# EAGLE schematic z80sim_pio_3_board2_v3 (EAGLE 9.6.2)

## Sheet 1 of 2
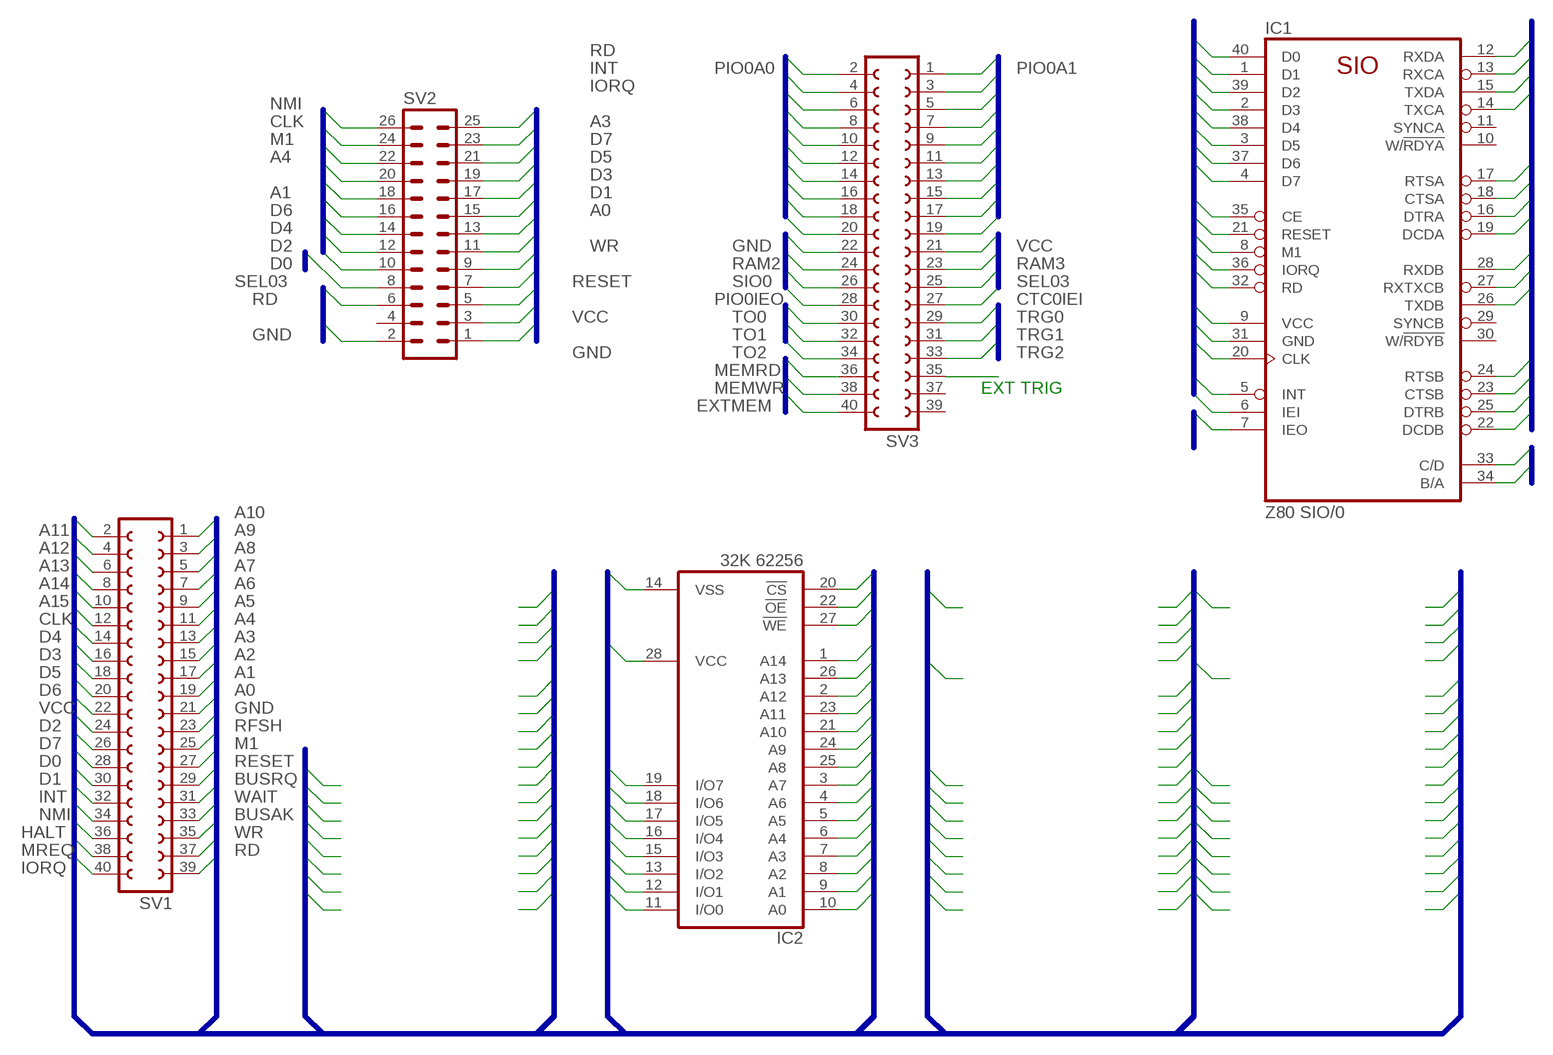
[diagram p0: schematic, sheet 1]

### Parts
IC1  Z80 SIO/0  Z80SIO  [DIL40]
IC2  32K 62256  62256P  [DIL28-6]
SV1  FE20-2  [FE20-2]
SV2  MA13-2  [MA13-2]
SV3  FE20-2  [FE20-2]

### Nets
32K_SEL: IC2.20(!CS) ; also sheet 2
A0: IC1.34(B/A) IC2.10(A0) SV1.21 SV2.9
A1: IC1.33(C/D) IC2.9(A1) SV1.19 SV2.18
A2: IC2.8(A2) SV1.17
A3: IC2.7(A3) SV1.15 SV2.19
A4: IC2.6(A4) SV1.13 SV2.20
A5: IC2.5(A5) SV1.11
A6: IC2.4(A6) SV1.9
A7: IC2.3(A7) SV1.7
A8: IC2.25(A8) SV1.5
A9: IC2.24(A9) SV1.3
A10: IC2.21(A10) SV1.1
A11: IC2.23(A11) SV1.2
A12: IC2.2(A12) SV1.4
A13: IC2.26(A13) SV1.6
A14: IC2.1(A14) SV1.8
A15: SV1.10
BUSAK: SV1.35
BUSRQ: SV1.31
CLK: IC1.20(CLK) SV1.12 SV2.24
CTC0IEI: IC1.7(IEO) SV3.27 ; also sheet 2
CTSA: IC1.18(CTSA)
CTSB: IC1.23(CTSB)
D0: IC1.40(D0) IC2.11(I/O0) SV1.28 SV2.10
D1: IC1.1(D1) IC2.12(I/O1) SV1.30 SV2.11
D2: IC1.39(D2) IC2.13(I/O2) SV1.24 SV2.12
D3: IC1.2(D3) IC2.15(I/O3) SV1.16 SV2.13
D4: IC1.38(D4) IC2.16(I/O4) SV1.14 SV2.14
D5: IC1.3(D5) IC2.17(I/O5) SV1.18 SV2.15
D6: IC1.37(D6) IC2.18(I/O6) SV1.20 SV2.16
D7: IC1.4(D7) IC2.19(I/O7) SV1.26 SV2.17
DCDA: IC1.19(DCDA)
DCDB: IC1.22(DCDB)
DTRA: IC1.16(DTRA)
DTRB: IC1.25(DTRB)
EXTMEM: SV3.40 ; also sheet 2
GND: IC1.31(GND) IC2.14(VSS) SV1.23 SV2.1 SV2.2 SV3.22 ; also sheet 2
HALT: SV1.36
INT: IC1.5(INT) SV1.32 SV2.23
IORQ: IC1.36(IORQ) SV1.40 SV2.21 ; also sheet 2
M1: IC1.8(M1) SV1.27 SV2.22
MEMRD: IC2.22(!OE) SV3.36
MEMWR: IC2.27(!WE) SV3.38
MREQ: SV1.38
N$4: SV3.35
NMI: SV1.34 SV2.26
PIO0A0: SV3.2
PIO0A1: SV3.1
PIO0A2: SV3.4
PIO0A3: SV3.3
PIO0A4: SV3.6
PIO0A5: SV3.5
PIO0A6: SV3.8
PIO0A7: SV3.7
PIO0ARDY: SV3.10
PIO0ASTB: SV3.9
PIO0B0: SV3.12
PIO0B1: SV3.11
PIO0B2: SV3.14
PIO0B3: SV3.13
PIO0B4: SV3.16
PIO0B5: SV3.15
PIO0B6: SV3.18
PIO0B7: SV3.17
PIO0BRDY: SV3.20
PIO0BSTB: SV3.19
PIO0IEO: SV3.28
RAM2: SV3.24
RAM3: SV3.23
RD: IC1.32(RD) SV1.39 SV2.6 SV2.25
RESET: IC1.21(RESET) SV1.29 SV2.5
RFSH: SV1.25
RTSA: IC1.17(RTSA)
RTSB: IC1.24(RTSB)
RXCA: IC1.13(RXCA)
RXDA: IC1.12(RXDA)
RXDB: IC1.28(RXDB)
RXTXCB: IC1.27(RXTXCB)
SEL03: SV2.8 SV3.25
SIO0: IC1.35(CE) SV3.26
TO0: SV3.30
TO1: SV3.32
TO2: SV3.34
TRG0: SV3.29
TRG1: SV3.31
TRG2: SV3.33
TXCA: IC1.14(TXCA)
TXDA: IC1.15(TXDA)
TXDB: IC1.26(TXDB)
VCC: IC1.6(IEI) IC1.9(VCC) IC2.28(VCC) SV1.22 SV2.3 SV3.21 ; also sheet 2
WAIT: SV1.33
WR: SV1.37 SV2.7
Unconnected: IC1.10(W/!RDYA) IC1.11(SYNCA) IC1.29(SYNCB) IC1.30(W/!RDYB) SV2.4 SV3.37 SV3.39

### Buses
M1,MREQ,IORQ,RD,WR,RFSH,HALT,WAIT,INT,NMI,RESET,BUSRQ,BUSAK,CLK,GND,VCC,A[0..15],D[0..7],MEMRD,MEMWR,IORD,IOWR,ROM0,RAM1,RAM2,RAM3,PIO0,CTC0,CTC0IEO,PIO0IEO,SIO0,SIO0IEO,SEL03,32K_SEL,ALT_BOOT
PIO0A0,PIO0A1,PIO0A2,PIO0A3,PIO0A4,PIO0A5,PIO0A6,PIO0A7,PIO0B0,PIO0B1,PIO0B2,PIO0B3,PIO0B4,PIO0B5,PIO0B6,PIO0B7,PIO0ARDY,PIO0ASTB,PIO0BRDY,PIO0BSTB,PIO0ARDY,PIO0ASTB,PIO0BRDY,PIO0BSTB,CTC0TRG0,CTC0TO0,CTC0TRG1,CTC0TO1,CTC0TRG2,CTC0TO2,CTC0TRG3
M1,MREQ,IORQ,RD,WR,RFSH,HALT,WAIT,INT,NMI,RESET,BUSRQ,BUSAK,CLK,GND,VCC,A[0..15],D[0..7],MEMRD,MEMWR,IORD,IOWR,ROM0,RAM1,RAM2,RAM3,PIO0,CTC0,CTC0IEO,CTC0IEI,PIO0IEO,SIO0,SEL03,EXTMEM
TRG0,TO0,TRG1,TO1,TRG2,TO2,TRG3
RXDA,RXCA,TXDA,TXCA,RTSA,CTSA,DTRA,DCDA,RXDB,RXTXCB,TXDB,RTSB,CTSB,DTRB,DCDB

### Notes on the sheet
- EXT TRIG

## Sheet 2 of 2
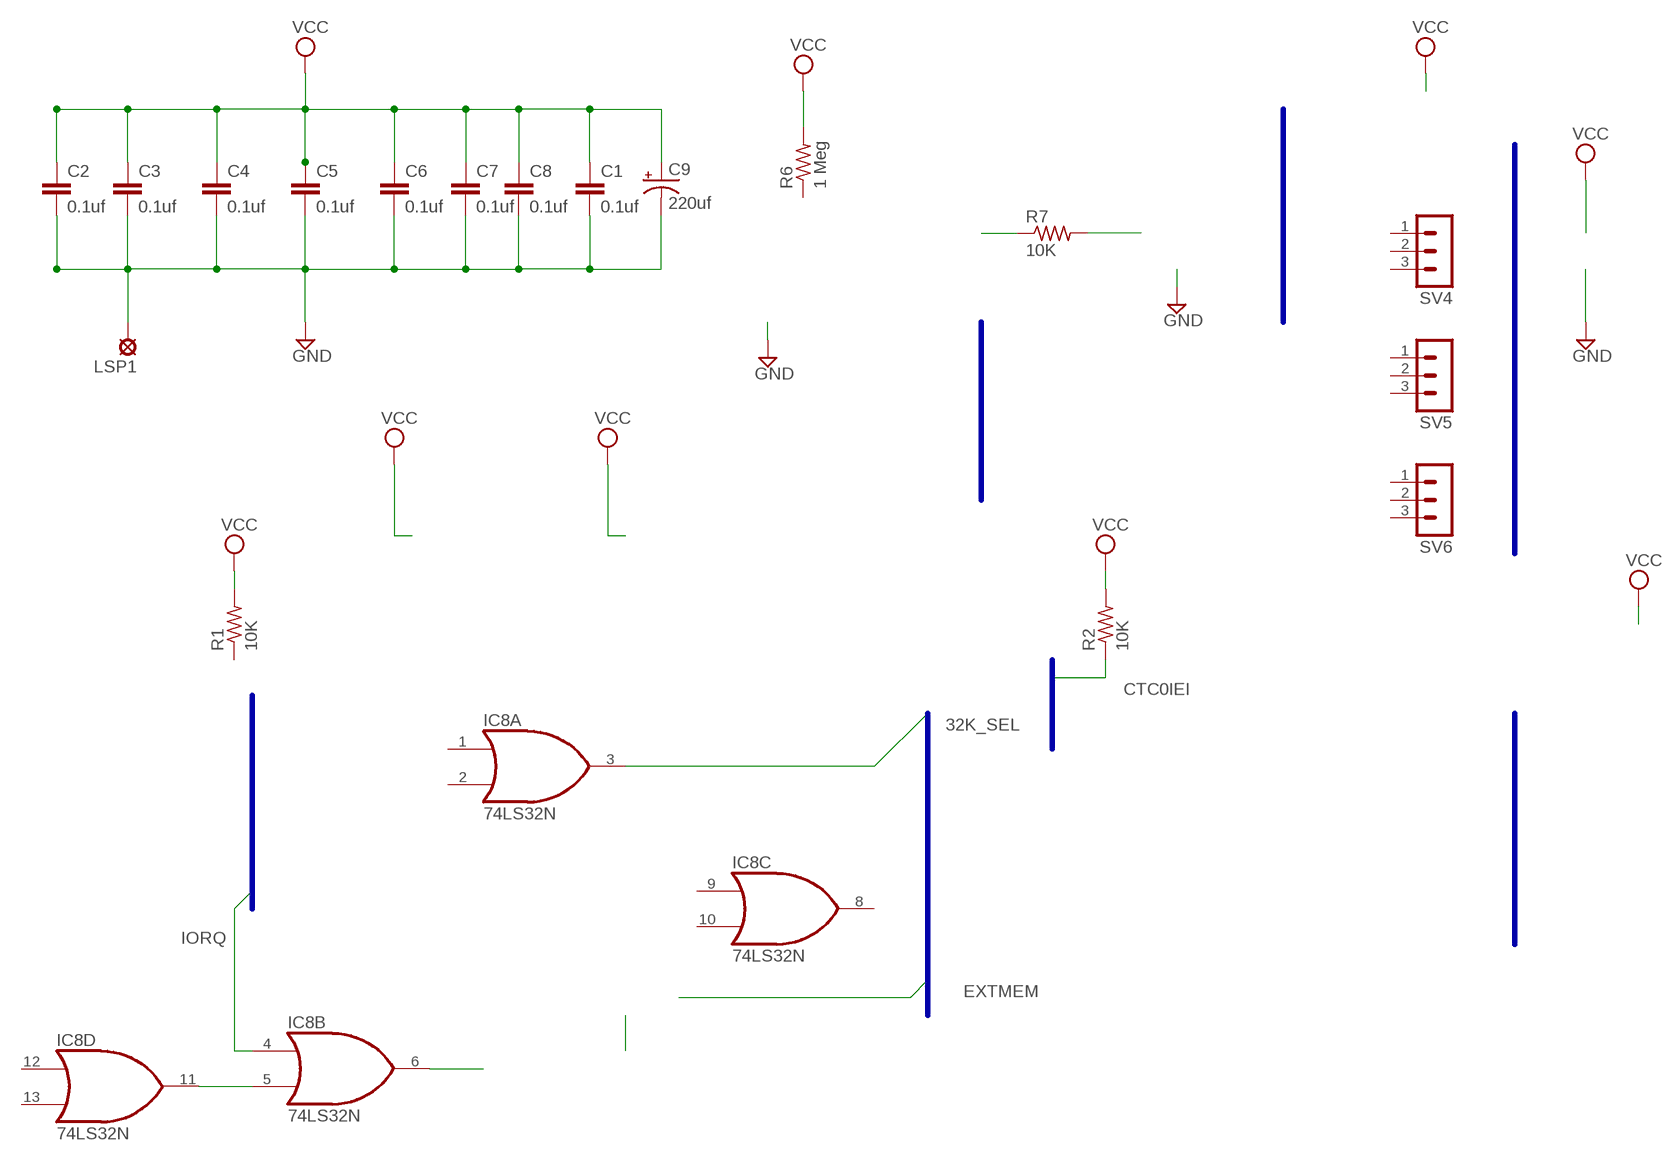
[diagram p1: schematic, sheet 2]

### Parts
C1  0.1uf  C5/3  [C5B3]
C2  0.1uf  C5/3  [C5B3]
C3  0.1uf  C5/3  [C5B3]
C4  0.1uf  C5/3  [C5B3]
C5  0.1uf  C5/3  [C5B3]
C6  0.1uf  C5/3  [C5B3]
C7  0.1uf  C5/3  [C5B3]
C8  0.1uf  C5/3  [C5B3]
C9  220uf  CPOL-USE3.5-10  [E3,5-10]
IC8  74LS32N  [DIL14]
LSP1  LSP13  [LSP13]
R1  10K  R-US_0204/7  [0204/7]
R2  10K  R-US_0204/7  [0204/7]
R6  1 Meg  R-US_0204/7  [0204/7]
R7  10K  R-US_0204/7  [0204/7]
SV4  MA03-1  [MA03-1]
SV5  MA03-1  [MA03-1]
SV6  MA03-1  [MA03-1]

### Nets
32K_SEL: IC8.3(A:O) ; also sheet 1
CTC0IEI: R2.1 ; also sheet 1
GND: C1.2 C2.2 C3.2 C4.2 C5.2 C6.2 C7.2 C8.2 C9.- LSP1.MP ; also sheet 1
IORQ: IC8.4(B:I0) ; also sheet 1
N$3: IC8.6(B:O)
N$6: IC8.5(B:I1) IC8.11(D:O)
N$9: R7.1
N$11: R7.2
VCC: C1.1 C2.1 C3.1 C4.1 C5.1 C6.1 C7.1 C8.1 C9.+ R1.2 R2.2 R6.2 ; also sheet 1
Unconnected: IC8.1(A:I0) IC8.2(A:I1) IC8.8(C:O) IC8.9(C:I0) IC8.10(C:I1) IC8.12(D:I0) IC8.13(D:I1) R1.1 R6.1 SV4.1 SV4.2 SV4.3 SV5.1 SV5.2 SV5.3 SV6.1 SV6.2 SV6.3

### Buses
M1,MREQ,IORQ,RD,WR,RFSH,HALT,WAIT,INT,NMI,RESET,BUSRQ,BUSAK,CLK,GND,VCC,A[0..15],D[0..7],MEMRD,MEMWR,IORD,IOWR,ROM0,RAM1,RAM2,RAM3,PIO0,CTC0,CTC0IEO,PIO0IEO,SIO0,SIO0IEO,SEL03,EXTMEM,32K_SEL,ALT_BOOT
M1,MREQ,IORQ,RD,WR,RFSH,HALT,WAIT,INT,NMI,RESET,BUSRQ,BUSAK,CLK,GND,VCC,A[0..15],D[0..7],MEMRD,MEMWR,IORD,IOWR,ROM0,RAM1,RAM2,RAM3,PIO0,CTC0,CTC0IEO,CTC0IEI,PIO0IEO,SIO0,SEL03,EXTMEM
TRG0,TO0,TRG1,TO1,TRG2,TO2,TRG3
RXDA,RXCA,TXDA,TXCA,RTSA,CTSA,DTRA,DCDA,RXDB,RXTXCB,TXDB,RTSB,CTSB,DTRB,DCDB

## Power pins joined to a net without a drawn wire
GND: IC8.7(P:GND)
VCC: IC8.14(P:VCC)

## Library data of the parts
C1-C8 = capacitor-wima:C: CAPACITOR naming: grid - package width
C9 = rcl:CPOL-US: POLARIZED CAPACITOR, American symbol
IC1 = zilog:Z80SIO: Z80 FAMILY DEVICE
IC2 = memory-hitachi:62256P: MEMORY; OC_FARNELL: unknown; OC_NEWARK: unknown
IC8 = 74xx-us:74*32: Quad 2-input OR gate
LSP1 = solpad:LSP13: SOLDER PAD drill 1.3 mm, distributor Buerklin, 12H562
R1 R2 R6 R7 = resistor:R-US_: RESISTOR, American symbol
SV1 SV3 = con-lsta:FE20-2: FEMALE HEADER; OC_FARNELL: unknown; OC_NEWARK: unknown
SV2 = con-lstb:MA13-2: PIN HEADER; OC_FARNELL: unknown; OC_NEWARK: unknown
SV4-SV6 = con-lstb:MA03-1: PIN HEADER; OC_FARNELL: unknown; OC_NEWARK: unknown